# Altium schematic sheet RTDAnalog.SchDoc
size A
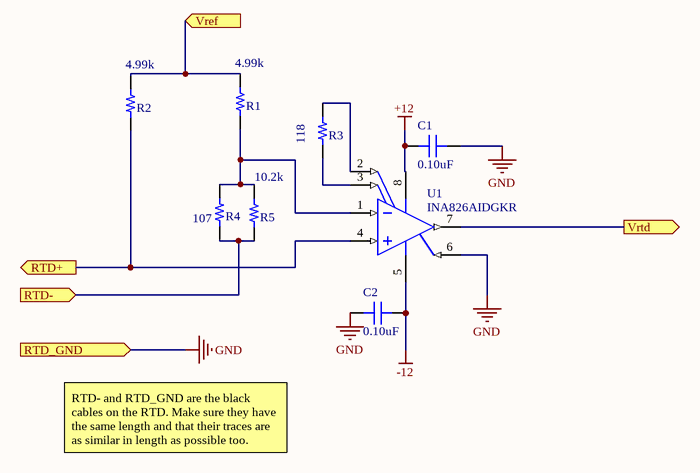
[diagram p0: RTDAnalog.SchDoc]

## Parts
C1  0.10uF  [CAP 0402/1005]
C2  0.10uF  [CAP 0402/1005]
R1  4.99k  [RES 0805/2012]
R2  4.99k  [RES 0805/2012]
R3  118  [RES 0805/2012]
R4  107  [RES 0805/2012]
R5  10.2k  [RES 0805/2012]
U1  INA826AIDGKR  [DGK0008A_N]

## Ports
RTD+ (out), RTD- (in), RTD_GND (in), Vref (in), Vrtd (out)

## Nets
+12: C1.1 U1.8(VS+)
-12: C2.2 U1.5(VS-)
GND: C1.2 C2.1 U1.6(REF) ; port RTD_GND
RTD+: R2.1 U1.4(IN+) ; port RTD+
RTD-: R4.1 R5.1 ; port RTD-
Vref: R1.2 R2.2 ; port Vref
Vrtd: U1.7(VOUT) ; port Vrtd
NetR1_1: R1.1 R4.2 R5.2 U1.1(IN-)
NetR3_1: R3.1 U1.3(RG)
NetR3_2: R3.2 U1.2(RG)

## Notes on the sheet
- RTD- and RTD_GND are the black cables on the RTD. Make sure they have the same length and that their traces are as similar in length as possible too.

## Library data of the parts
C1 C2 = GRM155R71C104JA88D: CAP CER 0.1UF 16V X7R 0402; Manufacturer: Murata Electronics North America; TemperatureRange: -55C ~ 125C; Tolerance: 5%; Value: 0.10uF; Part Number: GRM155R71C104JA88D; PartId: 12366; Supplier 1: Digi-Key; Supplier Part Number 1: 490-6327-2-ND; ComponentLink1Description: Datasheet; ComponentLink1URL: http://www.murata.com/~/media/webrenewal/support/library/catalog/products/capacitor/mlcc/c02e.pdf; ComponentLink2Description: Digi-Key Listing; ComponentLink2URL: https://www.digikey.com/product-detail/en/murata-electronics-north-america/GRM155R71C104JA88D/490-6327-2-ND/2610891; TemperatureCoefficient: X7R; Voltage: 16V; Price: 0.0046; Device Package: 0402 (1005 Metric)
R1 R2 = ERA-6AEB4991V: RES SMD 4.99K OHM 0.1% 1/8W 0805; Manufacturer: Panasonic Electronic Components; TemperatureRange: -55C ~ 155C; TemperatureCoefficient: 25ppm/C; PowerRating: 0.125W, 1/8W; Value: 4.99k; Part Number: ERA-6AEB4991V; PartId: 2457; Supplier 1: Digi-Key; Supplier Part Number 1: P4.99KDATR-ND; ComponentLink1Description: Datasheet; ComponentLink1URL: http://industrial.panasonic.com/lecs/www-data/pdf/AOA0000/AOA0000CE26.pdf; ComponentLink2Description: Digi-Key listing; ComponentLink2URL: http://digikey.com/product-detail/en/ERA-6AEB4991V/P4.99KDATR-ND/2025726; Tolerance: 0.1%; Price: 0.0653; Type: Thin Film; Device Package: 0805 (2012 Metric)
R3 = ERA-6AEB1180V: RES SMD 118 OHM 0.1% 1/8W 0805; Manufacturer: Panasonic Electronic Components; TemperatureRange: -55C ~ 155C; TemperatureCoefficient: 25ppm/C; PowerRating: 0.125W, 1/8W; Value: 118; Part Number: ERA-6AEB1180V; PartId: 2788; Supplier 1: Digi-Key; Supplier Part Number 1: P118DATR-ND; ComponentLink1Description: Datasheet; ComponentLink1URL: http://industrial.panasonic.com/lecs/www-data/pdf/AOA0000/AOA0000CE26.pdf; ComponentLink2Description: Digi-Key listing; ComponentLink2URL: http://digikey.com/product-detail/en/ERA-6AEB1180V/P118DATR-ND/2025579; Tolerance: 0.1%; Price: 0.0653; Type: Thin Film; Device Package: 0805 (2012 Metric)
R4 = ERA-6AEB1070V: RES SMD 107 OHM 0.1% 1/8W 0805; Manufacturer: Panasonic Electronic Components; TemperatureRange: -55C ~ 155C; TemperatureCoefficient: 25ppm/C; PowerRating: 0.125W, 1/8W; Value: 107; Part Number: ERA-6AEB1070V; PartId: 2810; Supplier 1: Digi-Key; Supplier Part Number 1: P107DATR-ND; ComponentLink1Description: Datasheet; ComponentLink1URL: http://industrial.panasonic.com/lecs/www-data/pdf/AOA0000/AOA0000CE26.pdf; ComponentLink2Description: Digi-Key listing; ComponentLink2URL: http://digikey.com/product-detail/en/ERA-6AEB1070V/P107DATR-ND/2025576; Tolerance: 0.1%; Price: 0.0653; Type: Thin Film; Device Package: 0805 (2012 Metric)
R5 = ERA-6AEB1022V: RES SMD 10.2K OHM 0.1% 1/8W 0805; Manufacturer: Panasonic Electronic Components; TemperatureRange: -55C ~ 155C; TemperatureCoefficient: 25ppm/C; PowerRating: 0.125W, 1/8W; Value: 10.2k; Part Number: ERA-6AEB1022V; PartId: 2668; Supplier 1: Digi-Key; Supplier Part Number 1: P10.2KDATR-ND; ComponentLink1Description: Datasheet; ComponentLink1URL: http://industrial.panasonic.com/lecs/www-data/pdf/AOA0000/AOA0000CE26.pdf; ComponentLink2Description: Digi-Key listing; ComponentLink2URL: http://digikey.com/product-detail/en/ERA-6AEB1022V/P10.2KDATR-ND/2025754; Tolerance: 0.1%; Price: 0.0653; Type: Thin Film; Device Package: 0805 (2012 Metric)
U1 = CMP-0944-00060-2: Precision, 200-uA Supply Current, 36-V Supply Instrumentation Amplifier, -40 to 125 degC, 8-pin SOP (DGK8), Green (RoHS & no Sb/Br); Manufacturer: Texas Instruments; Output Offset (+/-)(Max)(uV): 700; Input Offset Drift (+/-)(Max)(uV/Degrees Celsius): 2; Vs(Max)(V): 36; Non-Linearity (+/-)(Max)(%): 0.0005; Input Offset (+/-)(Max)(uV): 150; Output Offset Drift (+/-)(Max)(uV/Degrees Celsius): 10; Gain(V/V): 1 to 1000; CMRR(Min)(dB): 84; Noise at 1kHz(Typ)(nV/rt(Hz)): 18; Vs(Min)(V): 2.7; SubFamily: Single Supply; Number of Channels: 1; Input Bias Current (+/-)(Max)(nA): 65; Quiescent Current (+/-)(Typ)(mA): 0.2; ComponentLink1Description: Manufacturer URL; PartNumber: INA826AIDGKR; ComponentLink2URL: http://www.ti.com/general/docs/lit/getliterature.tsp?genericPartNumber=INA826&fileType=pdf; Code_JEDEC: MO-187; Eco-Plan: Green (RoHS & no Sb/Br); ComponentLink3URL: http://www.ti.com/litv/pdf/mpds028d; Mounting Technology: Surface Mount; ComponentLink3Description: Package Specification; PackageReference: DGK0008A; ComponentLink2Description: Datasheet; DatasheetVersion: SBOS562E; ComponentLink1URL: http://www.ti.com/; PackageDescription: 8-Pin Thin Small Outline, Body 3 x 3 mm, Pitch 0.65 mm; PackageVersion: 4073329/E, 05/2006